# EasyEDA Pro project ProPrj_42StepMotor_2025-09-30.epro, board PCB2
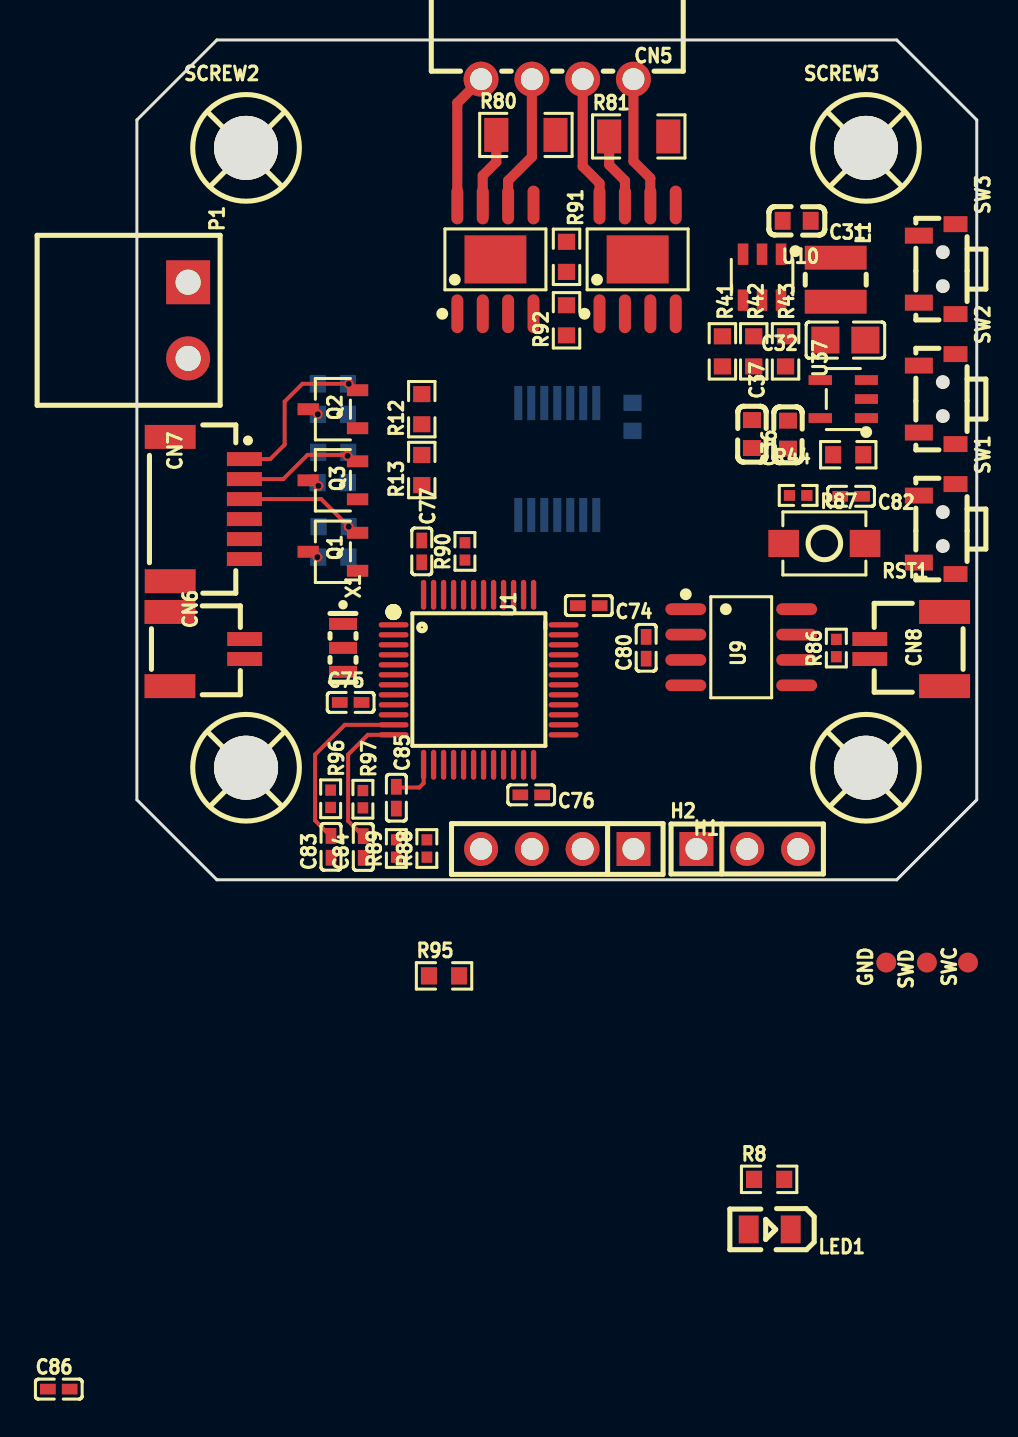
[diagram p4: board, top side]
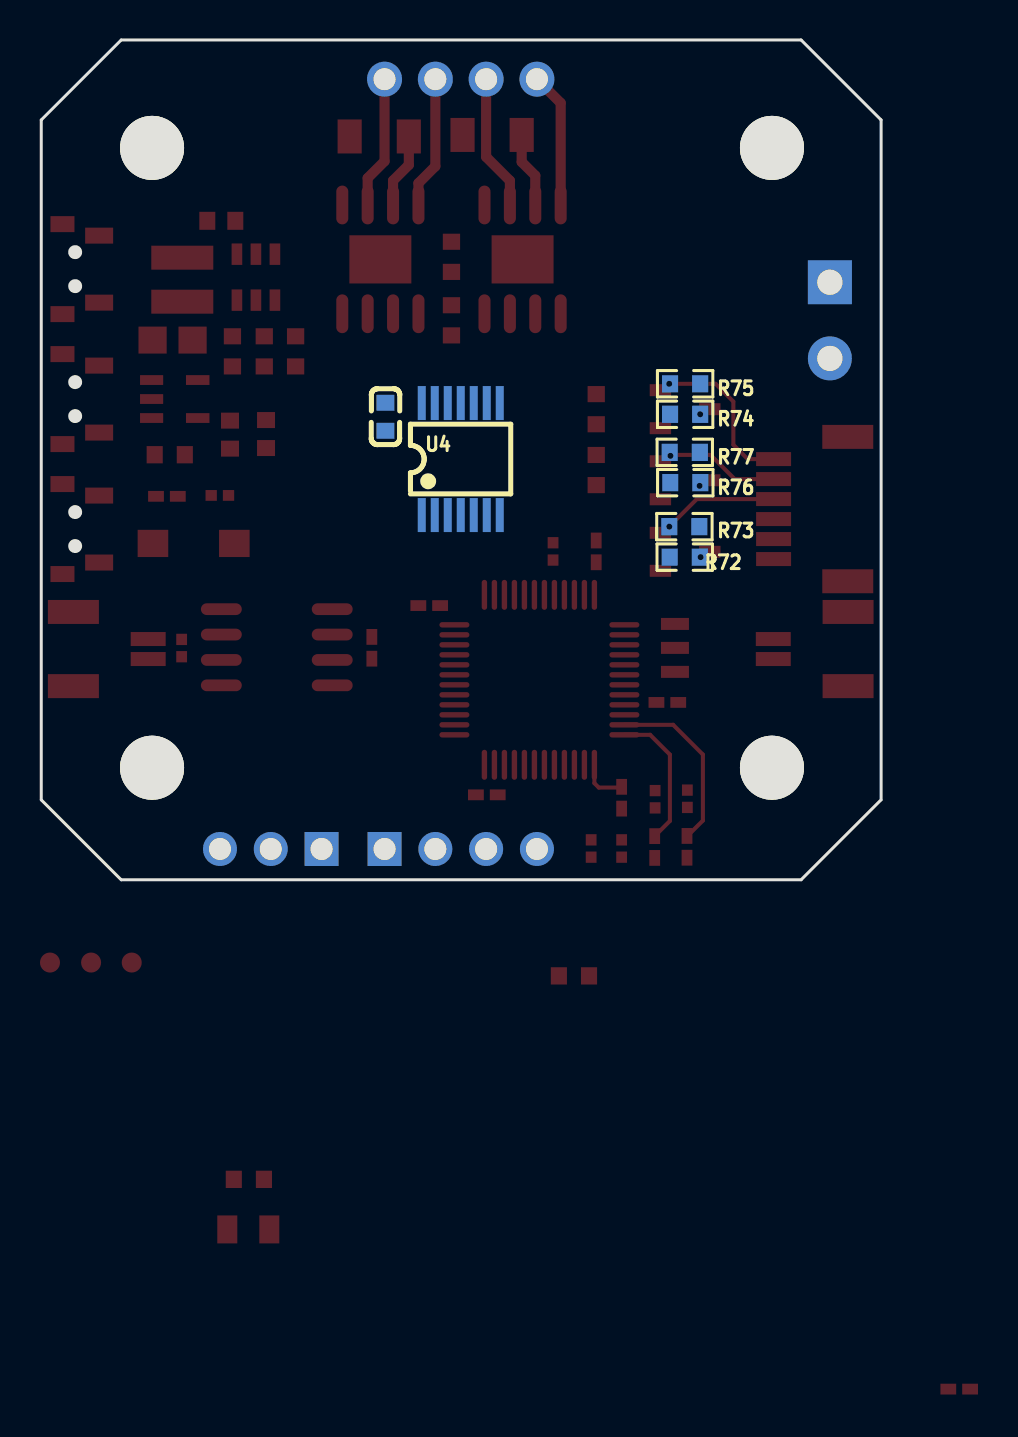
[diagram p5: board, bottom side, seen from below]

Outline 42 x 42 mm; copper layers: Top Layer, Bottom Layer. Coordinates in mm from the lower left corner of the outline.
Outline path: 0,38 4,42 38,42 42,38 42,4 38,0 4,0 0,4 0,38
Stack: Top Layer 0.035mm / Dielectric1 1.51mm FR4 er 4.5 / Bottom Layer 0.035mm

## Design rules (mm)
template: JLCPCB Capability(Two Layers Board)
spacing copperThickness1oz (default): track to track 0.102, other pairs 0.152 to 0.3
spacing copperThickness2oz: track to track 0.203, other pairs 0.152 to 0.3
track width copperThickness1oz (default): min 0.127, default 0.254, max 2.54
track width copperThickness2oz: min 0.203, default 0.254, max 2.54
differential pair differentialPair (default): width min 0.127, default 0.254, max 2.54; gap min 0.152, default 0.152
via viaSize (default): diameter min 0.5, default 0.61, max 10; hole min 0.3, default 0.305, max 6.3

## Placement (name value [footprint] x y rotation side)
C5  100nF  [C0603]  24.79 23.15 270 bottom
C31  100nF  [C0603]  33 32.96 180 top
C32  22uF  [C0805]  35.43 26.99 180 top
C36  10uF  [C0603]  32.56 22.26 90 top
C37  100nF  [C0603]  30.76 22.29 90 top
C74  100nF  [C0402]  22.6 13.71 180 top
C75  100nF  [C0402]  10.69 8.87 0 top
C76  100nF  [C0402]  19.72 4.25 180 top
C77  100nF  [C0402]  14.25 16.42 270 top
C80  100nF  [C0402]  25.47 11.6 90 top
C82  100nF  [C0402]  35.72 19.18 180 top
C83  2.2nF  [C0402]  9.71 1.65 90 top
C84  2.2nF  [C0402]  11.32 1.64 90 top
C85  2.2uF  [C0402]  12.98 4.1 270 top
C86  2.2uF  [C0402]  -3.91 -25.47 0 top
CN5  XH-4AW  [CONN-TH_XH-4AW]  21.02 40.04 180 top
CN6  HC-1.0-2PWT  [CONN-SMD_HC-1.0-2PWT]  3.52 11.54 270 top
CN7  HC-1.0-6PWT  [CONN-SMD_HCTL_HC-1.0-6PWT]  3.52 18.54 270 top
CN8  HC-1.0-2PWT  [CONN-SMD_HC-1.0-2PWT]  38.52 11.54 90 top
GND  GND  [Mark-Point-1mm]  37.48 -4.14 270 top
H1  2.54-1*4P母  [HDR-TH_4P-P2.54-V-F]  21.02 1.54 180 top
H2  PZ254V-11-03P  [HDR-TH_3P-P2.54-V-M]  30.52 1.54 0 top
L1  10uH  [IND-SMD_L3.0-W3.0_FTC303020D]  34.95 30.01 270 top
LED1  绿色  [LED0805-R-RD]  31.65 -17.49 180 top
P1  WJ15EDGRC-3.81-2P  [CONN-TH_2P-P3.81_WJ15EDGRC-3.81-2P]  2.56 27.98 270 top
Q1  BSS138  [SOT-23-3_L2.9-W1.6-P1.90-LS2.8-BR]  9.8 16.4 0 top
Q2  BSS138  [SOT-23-3_L2.9-W1.6-P1.90-LS2.8-BR]  9.8 23.54 0 top
Q3  BSS138  [SOT-23-3_L2.9-W1.6-P1.90-LS2.8-BR]  9.8 19.98 0 top
R8  10K  [R0603]  31.62 -14.98 0 top
R12  5.1K 1%  [R0603]  14.25 23.54 90 top
R13  1K 1%  [R0603]  14.25 20.49 90 top
R41  100K 1%  [R0603]  29.28 26.43 270 top
R42  12K 1%  [R0603]  30.85 26.43 90 top
R43  1.5K 1%  [R0603]  32.44 26.43 270 top
R44  100K  [R0603]  35.57 21.26 0 top
R72  10K  [R0603]  9.82 16.14 0 bottom
R73  10K  [R0603]  9.84 17.66 0 bottom
R74  10K  [R0603]  9.8 23.28 0 bottom
R75  10K  [R0603]  9.8 24.81 0 bottom
R76  10K  [R0603]  9.79 19.86 0 bottom
R77  10K  [R0603]  9.82 21.38 0 bottom
R80  100mΩ  [R1206]  19.45 37.25 0 top
R81  100mΩ  [R1206]  25.1 37.18 0 top
R86  120R 1%  [R0402]  34.98 11.59 90 top
R87  10K  [R0402]  33.07 19.22 180 top
R88  4.7K  [R0402]  14.5 1.56 90 top
R89  4.7K  [R0402]  12.98 1.56 90 top
R90  10K  [R0402]  16.41 16.42 90 top
R91  10K  [R0603]  21.49 31.16 270 top
R92  3.3KK 1%  [R0603]  21.49 27.98 90 top
R95  0Ω  [R0603]  15.36 -4.81 0 top
R96  100R  [R0402]  9.69 4.05 270 top
R97  100R  [R0402]  11.3 4.03 270 top
RST1  轻触按键3*4*H  [SW-SMD_L4.0-W2.9-LS5.0]  34.38 16.82 180 top
SCREW1  -  [M3螺丝]  5.52 5.54 0 top
SCREW2  -  [M3螺丝]  5.52 36.54 0 top
SCREW3  -  [M3螺丝]  36.52 36.54 0 top
SCREW4  -  [M3螺丝]  36.52 5.54 0 top
SW1  TS24CA 250gf 013  [SW-SMD_L4.7-W3.5-P3.35-EH]  40.02 17.54 270 top
SW2  TS24CA 250gf 013  [SW-SMD_L4.7-W3.5-P3.35-EH]  40.02 24.04 270 top
SW3  TS24CA 250gf 013  [SW-SMD_L4.7-W3.5-P3.35-EH]  40.02 30.54 270 top
SWC  SWC  [Mark-Point-1mm]  41.56 -4.14 270 top
SWD  SWD  [Mark-Point-1mm]  39.51 -4.14 270 top
U1  STM32F103C8T6  [LQFP-48_L7.0-W7.0-P0.50-LS9.0-BL]  17.09 10 270 top
U2  A4950ELJTR-T  [SOIC-8_L4.9-W3.9-P1.27-LS6.0-BL-EP]  25.04 31.03 0 top
U3  A4950ELJTR-T  [SOIC-8_L4.9-W3.9-P1.27-LS6.0-BL-EP]  17.93 31.03 0 top
U4  AS5047P-ATSM  [TSSOP-14_L5.0-W4.4-P0.65-LS6.4-BL]  21.02 21.04 180 bottom
U9  TJA1050T/CM-YJLTY  [SOIC-8_L4.9-W3.9-P1.27-LS6.0-BL]  30.22 11.63 270 top
U10  TPS54302DDCR  [SOT-23-6_L2.9-W1.6-P0.95-LS2.8-BL]  31.26 30.14 180 top
U37  RT9013-33GB  [SOT-23-5_L3.0-W1.7-P0.95-LS2.8-BL]  35.33 24.04 90 top
X1  8MHz  [OSC-SMD_3P-L3.2-W1.3-P1.20-L]  10.31 11.6 270 top

## Footprints (pads in the part's own frame, mm; a bottom-side part is the same pattern mirrored in y, then rotated)
C0402
  rect 0.79x0.54 smd: 1(-0.545,0) 2(0.545,0)
C0603
  rect 0.8x0.9 smd: 1(-0.7,0) 2(0.7,0)
C0805
  rect 1.41x1.35 smd: 1(-1,0) 2(1,0)
CONN-SMD_HC-1.0-2PWT
  rect 0.7x1.75 smd: 1(0.5,1.87) 2(-0.5,1.87)
  rect 1.2x2.55 smd: 3(-1.855,-1.87) 4(1.855,-1.87)
CONN-SMD_HCTL_HC-1.0-6PWT
  rect 0.7x1.75 smd: 1(-2.5,1.855) 2(-1.5,1.855) 3(-0.5,1.855) 4(0.5,1.855) 5(1.5,1.855) 6(2.5,1.855)
  rect 1.2x2.55 smd: 7(3.61,-1.855) 8(-3.61,-1.855)
CONN-TH_2P-P3.81_WJ15EDGRC-3.81-2P
  rect 2.2x2.2 hole 1.26: 1(-1.905,0)
  round 2.2 hole 1.26: 2(1.905,0)
CONN-TH_XH-4AW
  round 1.75 hole 1.1: 1(-3.81,0) 2(-1.27,0) 3(1.27,0) 4(3.81,0)
HDR-TH_3P-P2.54-V-M
  rect 1.7x1.7 hole 1.1: 1(-2.54,0)
  round 1.7 hole 1.1: 2(0,0) 3(2.54,0)
HDR-TH_4P-P2.54-V-F
  rect 1.7x1.7 hole 1.1: 1(-3.81,0)
  round 1.7 hole 1.1: 2(-1.27,0) 3(1.27,0) 4(3.81,0)
IND-SMD_L3.0-W3.0_FTC303020D
  rect 1.2x3.1 smd: 1(-1.1,0) 2(1.1,0)
LED0805-R-RD
  rect 1x1.399 smd: 1(1.05,0) 2(-1.05,0)
LQFP-48_L7.0-W7.0-P0.50-LS9.0-BL
  oval 0.27x1.5 smd: 1(-2.75,-4.25) 2(-2.25,-4.25) 3(-1.75,-4.25) 4(-1.25,-4.25) 5(-0.75,-4.25) 6(-0.25,-4.25) 7(0.25,-4.25) 8(0.75,-4.25) 9(1.25,-4.25) 10(1.75,-4.25) 11(2.25,-4.25) 12(2.75,-4.25) 25(2.75,4.25) 26(2.25,4.25) 27(1.75,4.25) 28(1.25,4.25) 29(0.75,4.25) 30(0.25,4.25) 31(-0.25,4.25) 32(-0.75,4.25) 33(-1.25,4.25) 34(-1.75,4.25) 35(-2.25,4.25) 36(-2.75,4.25)
  oval 1.5x0.27 smd: 13(4.25,-2.75) 14(4.25,-2.25) 15(4.25,-1.75) 16(4.25,-1.25) 17(4.25,-0.75) 18(4.25,-0.25) 19(4.25,0.25) 20(4.25,0.75) 21(4.25,1.25) 22(4.25,1.75) 23(4.25,2.25) 24(4.25,2.75) 37(-4.25,2.75) 38(-4.25,2.25) 39(-4.25,1.75) 40(-4.25,1.25) 41(-4.25,0.75) 42(-4.25,0.25) 43(-4.25,-0.25) 44(-4.25,-0.75) 45(-4.25,-1.25) 46(-4.25,-1.75) 47(-4.25,-2.25) 48(-4.25,-2.75)
M3螺丝
  round 3.2 hole 3.2: 1(-0.064,0.064)
Mark-Point-1mm
  round 1 smd: 1(0,0)
OSC-SMD_3P-L3.2-W1.3-P1.20-L
  rect 0.6x1.4 smd: 1(-1.199,0) 2(0,0) 3(1.199,0)
R0402
  rect 0.566x0.54 smd: 1(-0.433,0) 2(0.433,0)
R0603
  rect 0.806x0.864 smd: 1(-0.753,0) 2(0.753,0)
R1206
  rect 1.208x1.701 smd: 1(-1.479,0) 2(1.479,0)
SOIC-8_L4.9-W3.9-P1.27-LS6.0-BL
  oval 0.588x2.045 smd: 1(-1.905,-2.772) 2(-0.635,-2.772) 3(0.635,-2.772) 4(1.905,-2.772) 5(1.905,2.772) 6(0.635,2.772) 7(-0.635,2.772) 8(-1.905,2.772)
SOIC-8_L4.9-W3.9-P1.27-LS6.0-BL-EP
  oval 0.602x1.941 smd: 1(-1.905,-2.72) 2(-0.635,-2.72) 3(0.635,-2.72) 4(1.905,-2.72) 5(1.905,2.72) 6(0.635,2.72) 7(-0.635,2.72) 8(-1.905,2.72)
  rect 3.098x2.41 smd: 9(0,0)
SOT-23-3_L2.9-W1.6-P1.90-LS2.8-BR
  rect 1.07x0.6 smd: 1(1.235,-0.95) 2(1.235,0.95) 3(-1.235,0)
SOT-23-5_L3.0-W1.7-P0.95-LS2.8-BL
  rect 0.49x1.157 smd: 1(-0.95,-1.153) 2(0,-1.153) 3(0.95,-1.153)
  rect 0.49x1.175 smd: 4(0.95,1.153) 5(-0.95,1.153)
SOT-23-6_L2.9-W1.6-P0.95-LS2.8-BL
  rect 0.532x1.072 smd: 1(-0.95,-1.149) 2(0,-1.149) 3(0.95,-1.149) 4(0.95,1.149) 5(0,1.149) 6(-0.95,1.149)
SW-SMD_L4.0-W2.9-LS5.0
  rect 1.53x1.36 smd: 1(-2.035,0) 2(2.035,0)
SW-SMD_L4.7-W3.5-P3.35-EH
  rect 0.8x1.4 smd: 1(-1.675,-0.917) 2(1.675,-0.917)
  rect 0.8x1.2 smd: 3(-2.25,0.917) 4(2.25,0.917)
TSSOP-14_L5.0-W4.4-P0.65-LS6.4-BL
  rect 0.4x1.7 smd: 1(-1.95,-2.8) 2(-1.3,-2.8) 3(-0.65,-2.8) 4(0,-2.8) 5(0.65,-2.8) 6(1.3,-2.8) 7(1.95,-2.8) 8(1.95,2.8) 9(1.3,2.8) 10(0.65,2.8) 11(0,2.8) 12(-0.65,2.8) 13(-1.3,2.8) 14(-1.95,2.8)

## Nets
As in the schematic.

Pads without a net: SCREW1 1; SCREW2 1; SCREW3 1; SCREW4 1; U1 10 15 20 28; U4 8 9 10 14; U9 5; U10 5; U37 4

## Via types
v1: diameter 0.5, hole 0.3, Top Layer to Bottom Layer, 6 vias

## Routing (per net, layer and track width the routed paths; a pad name or vN(x,y) marks a point on that pad's centre or on a via; arc(x,y) is an arc through that point)
A+: length 6.6
  Top Layer w0.508: CN5.1 24.83,35.94 25.68,35.09 U2.6
A-: length 6.6
  Top Layer w0.508: U2.8 23.14,34.84 22.29,35.68 CN5.2
ADC_IA: length 9
  Top Layer w0.203: C83.2 9.68,2.19 8.91,2.96 8.91,6.26 10.4,7.75 U1.11
ADC_IB: length 7.1
  Top Layer w0.203: U1.12 11.55,7.25 10.56,6.26 10.56,2.94 C84.2
ADC_TEMP: length 2.4
  Top Layer w0.203: U1.13 14.34,4.83 14.12,4.61 13.01,4.61 C85.1
B+: length 6.8
  Top Layer w0.508: CN5.3 19.75,36.15 18.56,34.97 U3.6
B-: length 6.8
  Top Layer w0.508: U3.8 16.02,38.85 CN5.4
M_DIR: length 5.8
  Top Layer w0.203: CN7.2 7.32,20.04 8.53,21.25 10.46,21.25 10.59,21.12
  vias: v1(10.53,21.2)
M_ENA: length 6.4
  Top Layer w0.203: CN7.3 9.22,19.04 10.9,17.35 Q1.2
  vias: v1(10.59,17.66)
M_STEP: length 8
  Top Layer w0.203: CN7.1 6.67,21.04 7.39,21.76 7.39,23.92 8.28,24.81 v1(10.6,24.81)
SIG_DIR:
  vias: v1(9.08,19.7)
SIG_ENA:
  vias: v1(9.03,16.14)
SIG_STEP:
  vias: v1(9.05,23.28)
$1N4481: length 3.8
  Top Layer w0.508: R80.1 17.97,35.9 17.29,35.22 U3.7
$1N4611: length 3.8
  Top Layer w0.508: U2.7 24.41,34.97 23.62,35.75 R81.1
